# Altium schematic sheet Clock_Distribution.SchDoc: Clock Distribution
size 420 x 297 mm; Organization: Altium Limited; Address1: L3, 12a Rodborough Rd; Address2: Frenchs Forest; Address3: NSW; Address4: Australia 2086; SheetNumber: 1; SheetTotal: 8
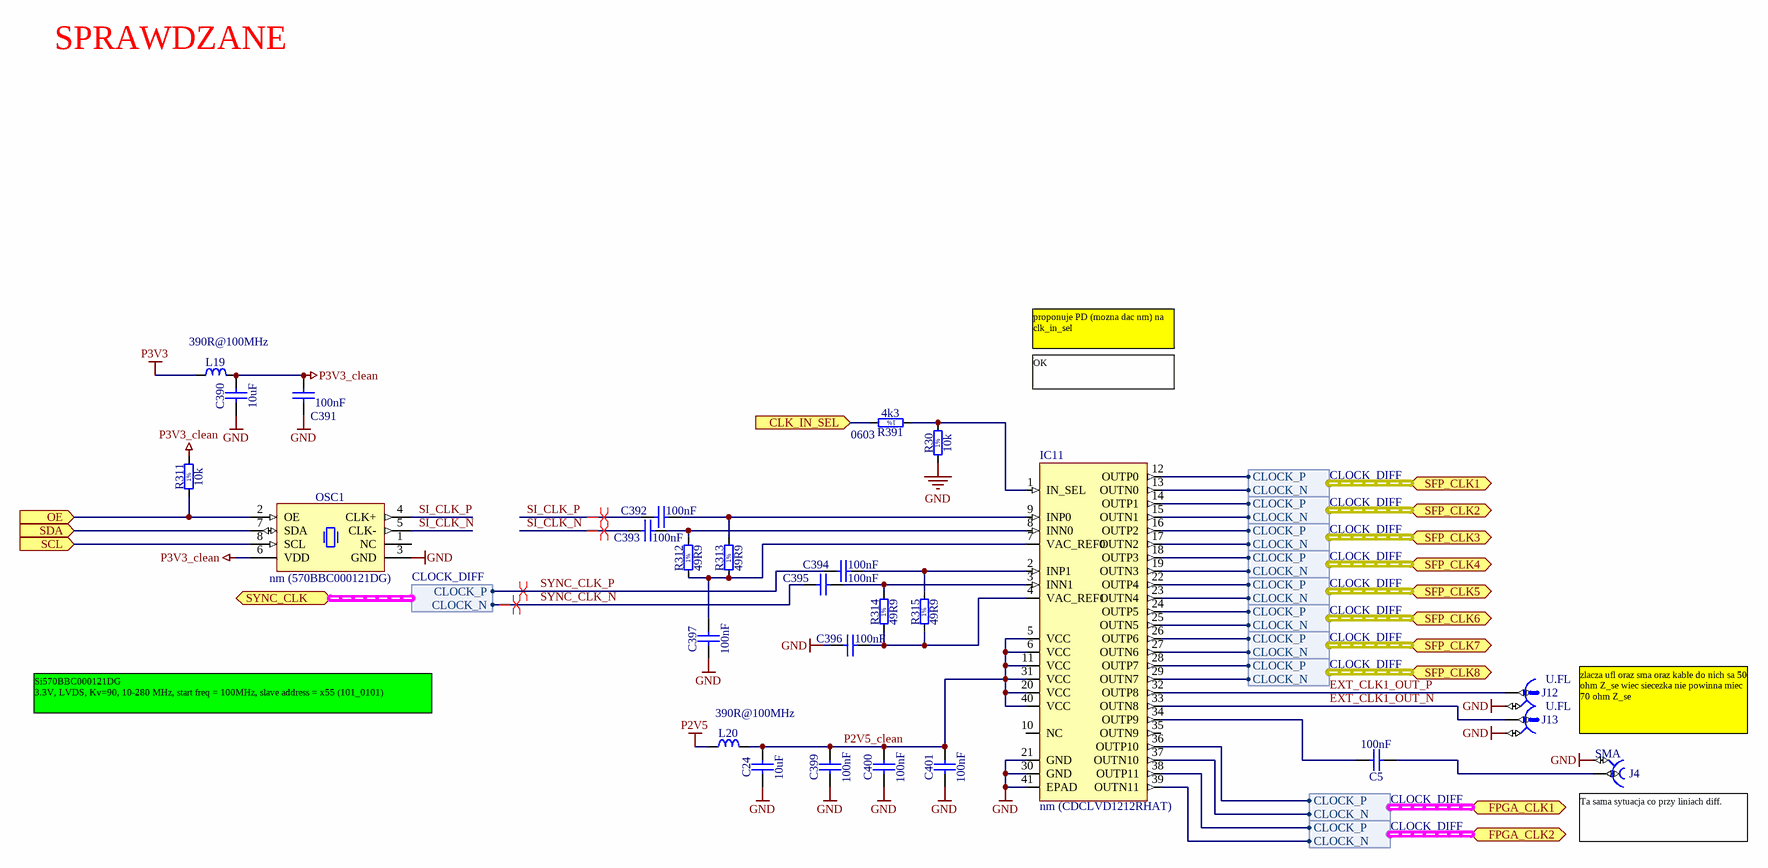
[diagram p0: Clock_Distribution.SchDoc]

## Parts
C5  100nF  [CAPC1005X55N]
C24  10uF  [CAPC2012X135N]
C390  10uF  [CAPC2012X135N]
C391  100nF  [CAPC0603X33N]
C392  100nF  [CAPC0603X33N]
C393  100nF  [CAPC0603X33N]
C394  100nF  [CAPC0603X33N]
C395  100nF  [CAPC0603X33N]
C396  100nF  [CAPC0603X33N]
C397  100nF  [CAPC0603X33N]
C399  100nF  [CAPC0603X33N]
C400  100nF  [CAPC0603X33N]
C401  100nF  [CAPC0603X33N]
IC11  nm (CDCLVD1212RHAT)  [QFN50P600-40]
J4  SMA  [HUBER-SUHNER_85 SMA-50-0-101/111 NE]
J12  U.FL  [HIROSE_U.FL-R-SMT-1(10)]
J13  U.FL  [HIROSE_U.FL-R-SMT-1(10)]
L19  390R@100MHz  [INDC1608X95N]
L20  390R@100MHz  [INDC1608X95N]
OSC1  nm (570BBC000121DG)  [OSC_SILICON-LAB_SI570]
R30  10k  [RESC1005X40N]
R311  10k  [RESC1005X40N]
R312  49R9  [RESC1005X40N]
R313  49R9  [RESC1005X40N]
R314  49R9  [RESC1005X40N]
R315  49R9  [RESC1005X40N]
R391  4k3  Case: 0603  [RESC1608X55N]

## Ports
CLK_IN_SEL (in), FPGA_CLK1 (harness CLOCK_DIFF), FPGA_CLK2 (harness CLOCK_DIFF), OE (in), SCL (in), SDA (in), SFP_CLK1 (harness CLOCK_DIFF), SFP_CLK2 (harness CLOCK_DIFF), SFP_CLK3 (harness CLOCK_DIFF), SFP_CLK4 (harness CLOCK_DIFF), SFP_CLK5 (harness CLOCK_DIFF), SFP_CLK6 (harness CLOCK_DIFF), SFP_CLK7 (harness CLOCK_DIFF), SFP_CLK8 (harness CLOCK_DIFF), SYNC_CLK (harness CLOCK_DIFF)

## Harnesses
CLOCK_DIFF: CLOCK_P, CLOCK_N

## Nets
GND: C24.1 C390.1 C391.1 C396.1 C397.1 C399.1 C400.1 C401.1 IC11.21(GND) IC11.30(GND) IC11.41(EPAD) J4.2 J12.2 J13.2 OSC1.3(GND) R30.1
P2V5: L20.1
P3V3: L19.1
P3V3_clean: C390.2 C391.2 L19.2 OSC1.6(VDD) R311.2
CLK_IN_SEL: R391.2 ; port CLK_IN_SEL
EXT_CLK1_OUT_N: IC11.33(OUTN8) J13.1
EXT_CLK1_OUT_P: IC11.32(OUTP8) J12.1
OE: OSC1.2(OE) R311.1 ; port OE
P2V5_clean: C24.2 C399.2 C400.2 C401.2 IC11.5(VCC) IC11.6(VCC) IC11.11(VCC) IC11.20(VCC) IC11.31(VCC) IC11.40(VCC) L20.2
SCL: OSC1.8(SCL) ; port SCL
SDA: OSC1.7(SDA) ; port SDA
SI_CLK_N: C393.2 OSC1.5(CLK-)
SI_CLK_P: C392.2 OSC1.4(CLK+)
SYNC_CLK_N: C395.2 ; port SYNC_CLK.CLOCK_N
SYNC_CLK_P: C394.2 ; port SYNC_CLK.CLOCK_P
NetC5_1: C5.1 IC11.34(OUTP9)
NetC5_2: C5.2 J4.1
NetC392_1: C392.1 IC11.9(INP0) R313.2
NetC393_1: C393.1 IC11.8(INN0) R312.2
NetC394_1: C394.1 IC11.2(INP1) R315.2
NetC395_1: C395.1 IC11.3(INN1) R314.2
NetC396_2: C396.2 IC11.4(VAC_REF1) R314.1 R315.1
NetC397_2: C397.2 IC11.7(VAC_REF0) R312.1 R313.1
NetIC11_1: IC11.1(IN_SEL) R30.2 R391.1
NetIC11_12: IC11.12(OUTP0) ; port SFP_CLK1.CLOCK_P
NetIC11_13: IC11.13(OUTN0) ; port SFP_CLK1.CLOCK_N
NetIC11_14: IC11.14(OUTP1) ; port SFP_CLK2.CLOCK_P
NetIC11_15: IC11.15(OUTN1) ; port SFP_CLK2.CLOCK_N
NetIC11_16: IC11.16(OUTP2) ; port SFP_CLK3.CLOCK_P
NetIC11_17: IC11.17(OUTN2) ; port SFP_CLK3.CLOCK_N
NetIC11_18: IC11.18(OUTP3) ; port SFP_CLK4.CLOCK_P
NetIC11_19: IC11.19(OUTN3) ; port SFP_CLK4.CLOCK_N
NetIC11_22: IC11.22(OUTP4) ; port SFP_CLK5.CLOCK_P
NetIC11_23: IC11.23(OUTN4) ; port SFP_CLK5.CLOCK_N
NetIC11_24: IC11.24(OUTP5) ; port SFP_CLK6.CLOCK_P
NetIC11_25: IC11.25(OUTN5) ; port SFP_CLK6.CLOCK_N
NetIC11_26: IC11.26(OUTP6) ; port SFP_CLK7.CLOCK_P
NetIC11_27: IC11.27(OUTN6) ; port SFP_CLK7.CLOCK_N
NetIC11_28: IC11.28(OUTP7) ; port SFP_CLK8.CLOCK_P
NetIC11_29: IC11.29(OUTN7) ; port SFP_CLK8.CLOCK_N
NetIC11_36: IC11.36(OUTP10) ; port FPGA_CLK1.CLOCK_P
NetIC11_37: IC11.37(OUTN10) ; port FPGA_CLK1.CLOCK_N
NetIC11_38: IC11.38(OUTP11) ; port FPGA_CLK2.CLOCK_P
NetIC11_39: IC11.39(OUTN11) ; port FPGA_CLK2.CLOCK_N

Not connected (* = marked no-connect by the designer): IC11 10(NC) 35(OUTN9); OSC1 1(NC)

## Layout directives
differential pair: SI_CLK_N, SI_CLK_P, SYNC_CLK_N, SYNC_CLK_P

## Notes on the sheet
- SPRAWDZANE
- proponuje PD (mozna dac nm) na clk_in_sel
- OK
- Si570BBC000121DG
  3.3V, LVDS, Kv=90, 10-280 MHz, start freq = 100MHz, slave address = x55 (101_0101)
- (near J4) zlacza ufl oraz sma oraz kable do nich sa 50 ohm Z_se wiec siecezka nie powinna miec 70 ohm Z_se
- (near J4) Ta sama sytuacja co przy liniach diff.
- Project/Equipment
- Document
- uTCA RTM 8 SFP+
- Designer
- Drawn by
- Check.by
- Copyright Creotech Instruments SA 2014.
  This documentation describes Open Hardware and is licensed under the CERN OHL v.1.1. You may redistribute and modify this documentation under the terms of the CERN OHL v.1.1. (http://ohwr.org/CERNOHL). This documentation is distributed WITHOUT ANY EXPRESS OR IMPLIED WARRANTY, INCLUDING OF MERCHANTABILITY, SATISFACTORY QUALITY AND FITNESS FOR A PARTICULAR PURPOSE. Please see the CERN OHL v.1.1 for applicable conditions.
- Creotech Instruments S.A.
- File
- Last Mod.
- Print Date
- Sheet
- Size
- A3
- of
- Rev
- (in symbol R0402_10K_1%_0.0625W_100PPM) 1%
- (in symbol R0402_49R9_1%_0.0625W_100PPM) 1%
- (in symbol R0603_4K3_1%_0.1W_100PPM) 1%

## Library data of the parts
C5 = CC0402_100NF_16V_10%_X7R: Non-polarised capacitor; Part Description: SMD Multilayer Chip Ceramic Capacitor; Manufacturer: GENERIC; Manufacturer1 Part Number: 223878715649; Voltage: 16V; TC: X7R; Tolerance: ±10%; Table: Capacitors SMD; Part Number: CC0402_100NF_16V_10%_X7R; Component Kind: Standard; Component Type: Standard; Pin Count: 2; Value: 100nF; Status: Not Recommended; Manufacturer Part Number: CC0402_100NF_16V_10%_X7R; Case: 0402; Mounted: Yes; Socket: No; SMD: Yes; Manufacturer1 Example: PHYCOMP; Manufacturer1 ComponentHeight: 0.55mm; HelpURL: \\cern.ch\dfs\Applications\Altium\Datasheets\CC0402_X7R_PHYCOMP.pdf; Author: CERN DEM JLC; CreateDate: 12/3/2007; LatestRevisionDate: 12/3/2007
C24 C390 = CC0805_10UF_10V_10%_X7R: Non-polarised capacitor; Part Description: SMD Multilayer Chip Ceramic Capacitor; Manufacturer: GENERIC; Manufacturer1 Part Number: GRM21BR71A106KE51L; Voltage: 10V; TC: X7R; Tolerance: ±10%; Table: Capacitors SMD; Part Number: CC0805_10UF_10V_10%_X7R; Component Kind: Standard; Component Type: Standard; Pin Count: 2; Value: 10uF; Status: Preferred; Manufacturer Part Number: CC0805_10UF_10V_10%_X7R; Case: 0805; Mounted: Yes; Socket: No; SMD: Yes; Manufacturer1 Example: MURATA; Manufacturer1 ComponentHeight: 1.35mm; HelpURL: \\cern.ch\dfs\Applications\Altium\Datasheets\CC0805_X7R_MURATA.pdf; Author: CERN DEM JLC; CreateDate: 2012-04-30; LatestRevisionDate: 2012-04-30
C391-C397 C399-C401 = CC0201_100NF_6.3V_10%_X5R: Non-polarised capacitor; Part Description: SMD Multilayer Chip Ceramic Capacitor; Manufacturer: GENERIC; Manufacturer1 Part Number: 02016D104KAT2A; Voltage: 6.3V; TC: X5R; Tolerance: ±10%; Table: Capacitors SMD; Part Number: CC0201_100NF_6.3V_10%_X5R; Component Kind: Standard; Component Type: Standard; Pin Count: 2; Value: 100nF; Status: Not Recommended; Manufacturer Part Number: CC0201_100NF_6.3V_10%_X5R; Case: 0201; Mounted: Yes; Socket: No; SMD: Yes; Manufacturer1 Example: AVX; Manufacturer1 ComponentHeight: 0.33mm; HelpURL: \\cern.ch\dfs\Applications\Altium\Datasheets\CC0201_X5R_AVX.pdf; Author: CERN DEM JLC; CreateDate: 2007-12-03; LatestRevisionDate: 2007-12-03
IC11 = CLOCK_CDCLVD1212: Low Jitter, 2-Input Selectable 1:12 Universal-to-LVDS Buffer
J4 = HUBER-SUHNER_85_SMA-50-0-101/111_NE: Part Description: SMA 50 Ohms Right Angle PCB Jack; Manufacturer: HUBER+SUHNER; Table: Miscellaneous; Part Number: HUBER-SUHNER_85_SMA-50-0-101/111_NE; Component Kind: Standard; Component Type: Standard; Pin Count: 2; Family: SMA; Mounted: Yes; Socket: No; SMD: No; Status: None; Manufacturer Part Number: 85_SMA-50-0-101/111_NE; ComponentHeight: 9.6mm; HelpURL: \\cern.ch\dfs\Applications\Altium\Datasheets\HUBER-SUHNER_85 SMA-50-0-101-111 NE.pdf; Author: CERN DEM JLC; CreateDate: 2010-04-20; LatestRevisionDate: 2010-04-27
J12 J13 = HIROSE_U.FL-R-SMT-1(10): Part Description: Up to 6GHz Ultra Small Surface Mount Male Coaxial Connectors U.FL Series; Manufacturer: HIROSE (HRS); Table: Miscellaneous; Part Number: HIROSE_U.FL-R-SMT-1(10); Component Kind: Standard; Component Type: Standard; Pin Count: 2; Family: U.FL; Mounted: Yes; Socket: No; SMD: Yes; Status: None; Manufacturer Part Number: U.FL-R-SMT-1(10); ComponentHeight: 1.25mm; HelpURL: \\cern.ch\dfs\Applications\Altium\Datasheets\HIROSE_U.FL-R-SMT-1(10).pdf; Author: CERN DEM JLC; CreateDate: 2010-03-24; LatestRevisionDate: 2010-03-24
L19 L20 = IND0603_TDK_MPZ1608R391A: Inductor; Part Description: SMT Chip Bead for Power Line; Manufacturer: TDK; Power: 1.2A; Resistance: 0.12R; Tolerance: ±25%; Table: Inductors SMD; Part Number: IND0603_TDK_MPZ1608R391A; Component Kind: Standard; Component Type: Standard; Pin Count: 2; Value: 390R@100MHz; Status: None; Manufacturer Part Number: MPZ1608R391A; Case: 0603; Mounted: Yes; Socket: No; SMD: Yes; ComponentHeight: 0.95mm; HelpURL: \\cern.ch\dfs\Applications\Altium\Datasheets\IND0603_TDK_MPZ1608.pdf; Author: CERN DEM JLC; CreateDate: 2009-12-02; LatestRevisionDate: 2009-12-02
OSC1 = OSC_10-280MHZ_SILICON-LAB_Si570BBC000121DG: Any-Rate I2C Programmable XO Oscillator Si570 Serie; Part Description: 10-280MHz 3.3V ±20ppm LVDS Any-Rate I2C Programmable XO Oscillator Si570 Serie; Manufacturer: SILICON LABS; Value: 100MHz; Table: Crystals & Oscillators; Part Number: OSC_10-280MHZ_SILICON-LAB_Si570BBC000121DG; Component Kind: Standard; Component Type: Standard; PackageDescription: Oscillator Si570 Serie, 8 pins, 5x7mm; Manufacturer Part Number: 570BBC000121DG; Pin Count: 8; Mounted: Yes; Socket: No; SMD: Yes; ComponentHeight: 1.85mm; HelpURL: \\cern.ch\dfs\Applications\Altium\Datasheets\OSC_SILICON-LAB_SI570.pdf; Author: CERN DEM JLC; CreateDate: 2010-02-09; LatestRevisionDate: 2012-03-26
R30 = R0402_10K_1%_0.0625W_100PPM: Resistor - 1%; Part Description: General Purpose Thick Film Chip Resistor; Manufacturer: GENERIC; Manufacturer1 Part Number: 232270671003L; TC: ±100ppm/°C; Mounted: No; Table: Resistors SMD; Part Number: R0402_10K_1%_0.0625W_100PPM; Component Kind: Standard; Component Type: Standard; Pin Count: 2; Value: 10k; Status: Not recommended; Power: 0.0625W; Tolerance: ±1%; Manufacturer Part Number: R0402_10K_1%_0.0625W_100PPM; Case: 0402; Socket: No; SMD: Yes; Manufacturer1 Example: YAGEO PHYCOMP; Manufacturer1 ComponentHeight: 0.4mm; HelpURL: \\cern.ch\dfs\Applications\Altium\Datasheets\R0402_Phycomp_RC0402.pdf; Author: CERN DEM JLC; CreateDate: 2007-12-03; LatestRevisionDate: 2012-10-17
R311 = R0402_10K_1%_0.0625W_100PPM: Resistor - 1%; Part Description: General Purpose Thick Film Chip Resistor; Manufacturer: GENERIC; Manufacturer1 Part Number: 232270671003L; TC: ±100ppm/°C; Table: Resistors SMD; Part Number: R0402_10K_1%_0.0625W_100PPM; Component Kind: Standard; Component Type: Standard; Pin Count: 2; Value: 10k; Status: Not recommended; Power: 0.0625W; Tolerance: ±1%; Manufacturer Part Number: R0402_10K_1%_0.0625W_100PPM; Case: 0402; Mounted: Yes; Socket: No; SMD: Yes; Manufacturer1 Example: YAGEO PHYCOMP; Manufacturer1 ComponentHeight: 0.4mm; HelpURL: \\cern.ch\dfs\Applications\Altium\Datasheets\R0402_Phycomp_RC0402.pdf; Author: CERN DEM JLC; CreateDate: 2007-12-03; LatestRevisionDate: 2012-10-17
R312-R315 = R0402_49R9_1%_0.0625W_100PPM: Resistor - 1%; Part Description: General Purpose Thick Film Chip Resistor; Manufacturer: GENERIC; Manufacturer1 Part Number: 232270674999L or RC0402FR-0749R9L; TC: ±100ppm/°C; Table: Resistors SMD; Part Number: R0402_49R9_1%_0.0625W_100PPM; Component Kind: Standard; Component Type: Standard; Pin Count: 2; Value: 49R9; Status: Not recommended; Power: 0.0625W; Tolerance: ±1%; Manufacturer Part Number: R0402_49R9_1%_0.0625W_100PPM; Case: 0402; Mounted: Yes; Socket: No; SMD: Yes; Manufacturer1 Example: YAGEO PHYCOMP; Manufacturer1 ComponentHeight: 0.4mm; HelpURL: \\cern.ch\dfs\Applications\Altium\Datasheets\R0402_Phycomp_RC0402.pdf; Author: CERN DEM JLC; CreateDate: 2012-10-24; LatestRevisionDate: 2012-10-24
R391 = R0603_4K3_1%_0.1W_100PPM: Resistor - 1%; Part Description: General Purpose Thick Film Chip Resistor; Manufacturer: GENERIC; Manufacturer1 Part Number: NRC06F4301TRF; Power: 0.1W; TC: ±100ppm/°C; Table: Resistors SMD; Part Number: R0603_4K3_1%_0.1W_100PPM; Component Kind: Standard; Component Type: Standard; Pin Count: 2; Value: 4k3; Status: Preferred; Tolerance: ±1%; Manufacturer Part Number: R0603_4K3_1%_0.1W_100PPM; Mounted: Yes; Socket: No; SMD: Yes; Manufacturer1 Example: NIC COMPONENT; Manufacturer1 ComponentHeight: 0.55mm; HelpURL: \\cern.ch\dfs\Applications\Altium\Datasheets\R0603_NIC_NRC.pdf; Author: CERN DEM JLC; CreateDate: 2007-12-03; LatestRevisionDate: 2008-03-13